# EAGLE design ledstringpowerMar2021 (EAGLE 9.6.2)
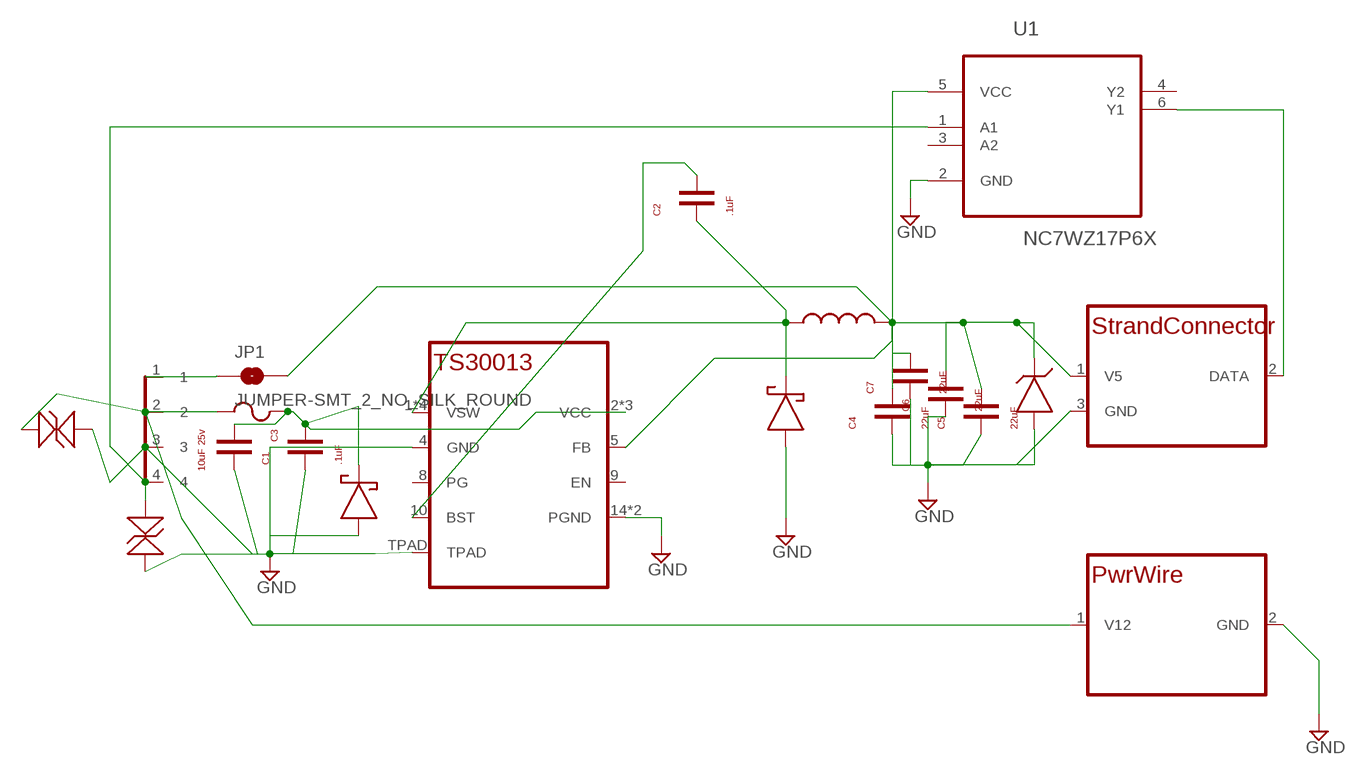
[diagram p0: schematic, sheet 1]

## Parts
C1  .1uF  CAPACITOR_NONPOLARC0603  [C0603]
C2  .1uF  CAPACITOR_NONPOLARC0603  [C0603]
C3  10uF 25v  CL31A106MAHNNNEC1206  [C1206]
C4  22uF  GRM188R61A226ME15DC0603  [C0603]
C5  22uF  GRM188R61A226ME15DC0603  [C0603]
C6  22uF  GRM188R61A226ME15DC0603  [C0603]
C7  22uF  GRM188R61A226ME15DC0603  [C0603]
D2  LS54LS54DEVINST  [LS54]
F1  3A  FUSER0603  [R0603]
IC1  TS30013QFN16  [QFN16]
JP1  JUMPER-SMT_2_NO_SILK_ROUND  [SMT-JUMPER_2_NO_SILK_ROUND]
L1  SRN5040TA-4R7MSRN5040TA  [SRN5040TA]
TVS1  DESD5V0U1BL-7BDFN1006-2  [DFN1006-2]
TVS2  DESD5V0U1BL-7BDFN1006-2  [DFN1006-2]
U1  NC7WZ17P6X  [SOT65P210X110-6N]
U$1  1SMB5930BT3G1SMB5930BT3GDEVINST  [1SMB5930BT3G]
U$2  MMSZ5231BT3G-5V1-ZENERSOD123DEVINST  [SOD123]
U$3  TE-1969806-1TE-1969806-1  [TE-1969806-1]
U$5  LEDSTRANDDLEDWIREP  [LEDWIREP]
U$8  PWRWIREDPWRWIREP  [PWRWIREP]

## Nets
DATA: TVS2.2 U1.1(A1) U$3.4
GND: C1.1 C3.2 C4.1 C5.1 C6.1 C7.1 D2.1 IC1.4(GND) IC1.14(PGND) IC1.15(PGND) IC1.TPAD TVS1.1 TVS2.1 U1.2(GND) U$1.1 U$2.1 U$3.3 U$5.3(GND) U$8.2(GND)
N$1: U1.6(Y1) U$5.2(DATA)
N$3: C2.1 D2.2 IC1.1(VSW) IC1.12(VSW) IC1.13(VSW) IC1.16(VSW) L1.1
N$5: C2.2 IC1.10(BST)
N$7: JP1.1 U$3.1
V5: C4.2 C5.2 C6.2 C7.2 IC1.5(FB) JP1.2 L1.2 U1.5(VCC) U$2.2 U$5.1(V5)
V12: F1.1 TVS1.2 U$3.2 U$8.1(V12)
VCC: C1.2 C3.1 F1.2 IC1.2(VCC) IC1.3(VCC) IC1.11(VCC) U$1.2
Unconnected: IC1.8(PG) IC1.9(EN) U1.3(A2) U1.4(Y2)

## Library data of the parts
C1 C2 = ledinlinesupply:CAPACITOR_NONPOLAR
C3 = ledinlinesupply:CL31A106MAHNNNE
C4-C7 = ledinlinesupply:GRM188R61A226ME15D
D2 = ledinlinesupply:LS54
F1 = ledinlinesupply:FUSE
IC1 = ledinlinesupply1:TS30013
JP1 = SparkFun-Jumpers:JUMPER-SMT_2_NO: Normally open jumper This jumper has two pads in close proximity to each other. Apply solder to close the connection. Round pads are easier to solder for beginners, but are a lot larger. SparkFun Product that uses the round pads: SparkFun EL Sequencer <https://www.sparkfun.com/products/12781>
L1 = ledinlinesupply:SRN5040TA-4R7M
TVS1 TVS2 = ledinlinesupply:DESD5V0U1BL-7B
U1 = NC7WZ17P6X_dual_schmitt_buffer:NC7WZ17P6X: Dual Buffer; MPN: NC7WZ17P6X; OC_FARNELL: 1651986; OC_NEWARK: 38C7625; PACKAGE: SC-70-6; SUPPLIER: FAIRCHILD SEMICONDUCTOR
U$1 = ledinlinesupply:1SMB5930BT3G
U$2 = ledinlinesupply:MMSZ5231BT3G-5V1-ZENER
U$3 = ledinlinesupply:TE-1969806-1
U$5 = ledinlinesupply:LEDSTRANDD
U$8 = ledinlinesupply:PWRWIRED

## Board
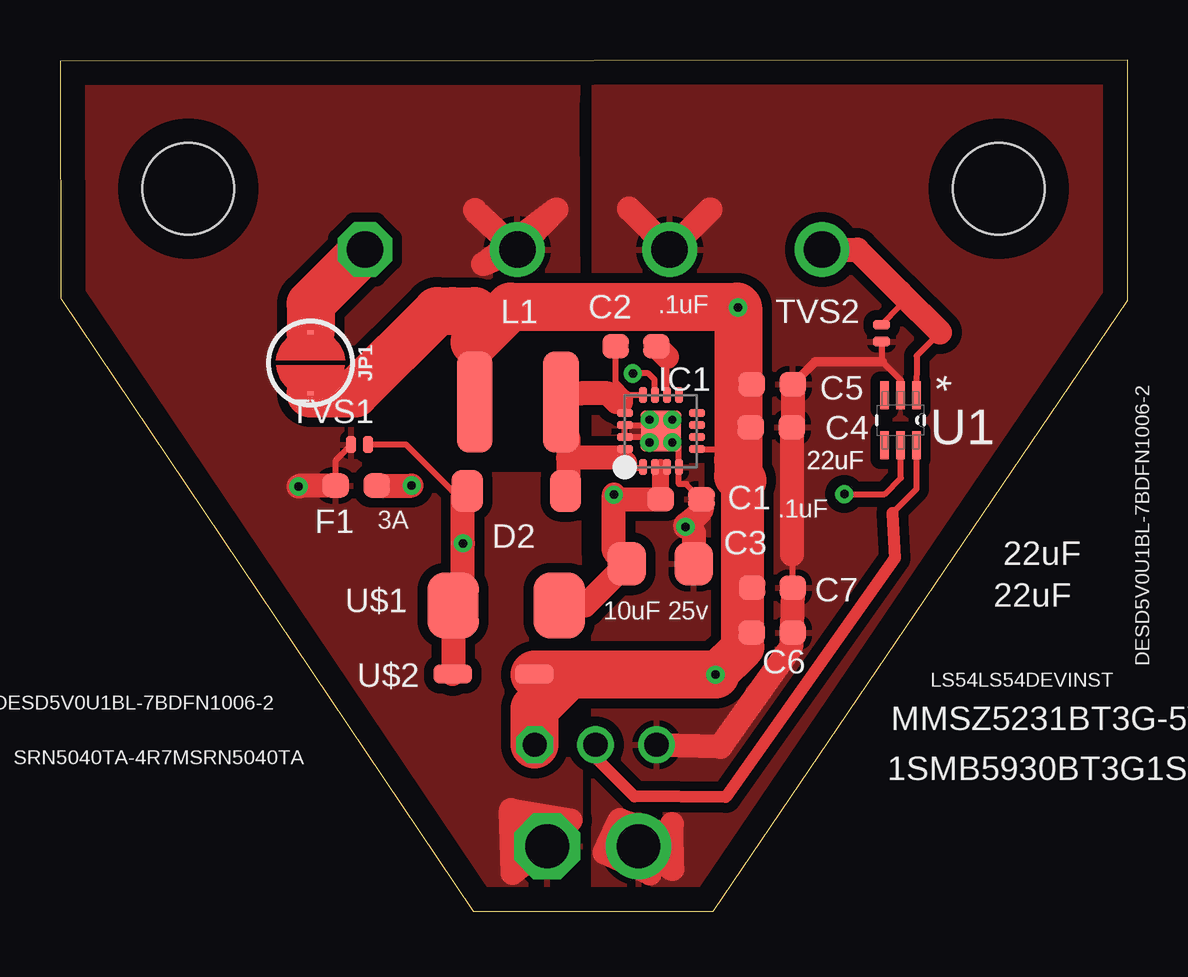
[diagram p1: board, top side]
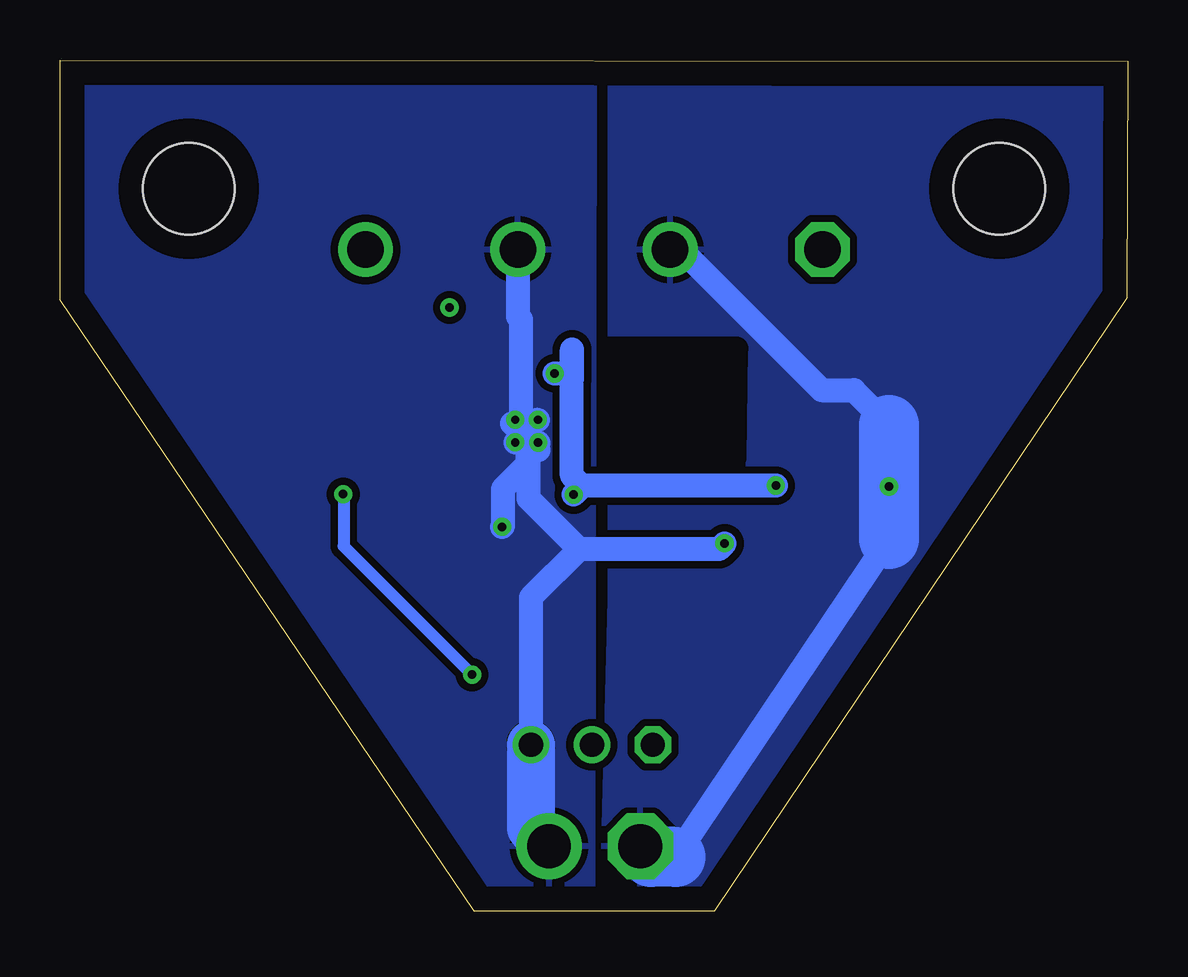
[diagram p2: board, bottom side, seen from below]

Size 44.48 x 35.47 mm. Coordinates in mm from the lower left corner, seen from the top.
Outline: 17.21,0 27.21,0 44.48,25.47 44.48,35.47 0,35.41 0.03,25.55 17.21,0
Copper layers (1*16): Top 0.035mm / dielectric 1.5mm / Bottom 0.035mm
Design rules "default": minimum track width 6mil, minimum drill 0.35mm, track to track 6mil, track to pad 6mil, pad to pad 6mil, via to via 6mil, smd to smd 6mil, copper to edge 40mil, drill to drill 6mil, minimum pad ring 10mil, minimum via ring 8mil, stop-mask expansion 4mil, vias tented up to drill 0mil, thermal gap 10mil
tRestrict: area 18.2,18.9 to 19.8,22.9
bRestrict: area 16.3,18.9 to 21.5,23.4

### Footprints (pad centres in the part's own frame; a part is rotated, then mirrored left to right if it is on the bottom)
C0603 = smd 1.1 x 1: 1 -0.85,0; 2 0.85,0
C1206 = smd 1.6 x 1.8: 1 -1.4,0; 2 1.4,0
LS54 = smd 1.3 x 1.75: 1 -2.05,0; 2 2.05,0
R0603 = smd 1.1 x 1: 1 -0.85,0; 2 0.85,0
QFN16 = smd 0.65 x 0.34: 1 -1.5,0.75; 2 -1.5,0.25; 3 -1.5,-0.25; 4 -1.5,-0.75; 9 1.5,-0.75; 10 1.5,-0.25; 11 1.5,0.25; 12 1.5,0.75 | smd 0.34 x 0.65: 5 -0.75,-1.5; 6 -0.25,-1.5; 7 0.25,-1.5; 8 0.75,-1.5; 13 0.75,1.5; 14 0.25,1.5; 15 -0.25,1.5; 16 -0.75,1.5 | smd 1.7 x 1.7: TPAD 0,0
SMT-JUMPER_2_NO_SILK_ROUND = smd 0.152 x 0.305: 1 -1.27,0; 2 1.27,0
SRN5040TA = smd 1.5 x 4.2: 1 -1.8,0; 2 1.8,0
DFN1006-2 = smd 0.4 x 0.7: 1 -0.35,0; 2 0.35,0
SOT65P210X110-6N = smd 1.168 x 0.356: 1 -1.041,0.66; 2 -1.041,0; 3 -1.041,-0.66; 4 1.041,-0.66; 5 1.041,0; 6 1.041,0.66
1SMB5930BT3G = smd 2.159 x 2.743: 1 -2.21,0; 2 2.21,0
SOD123 = smd 1.6 x 0.8: 1 -1.7,0; 2 1.7,0
TE-1969806-1 = drill 1.52 octagon: 1 -9.525,0 | drill 1.52: 2 -3.175,0; 3 3.175,0; 4 9.525,0 | hole 3.81: -16.89,2.54; 16.89,2.54
LEDWIREP = drill 1.016 octagon: 1 -2.54,0 | drill 1.016: 2 0,0; 3 2.54,0
PWRWIREP = drill 1.829 octagon: 1 -1.905,0 | drill 1.829: 2 1.905,0

### Placement (x,y rotation side)
C1  25.88,17.17 180 top
C2  24,23.54 0 top
C3  25.01,14.48 0 top
C4  29.64,20.17 180 top
C5  29.68,21.96 180 top
C6  29.68,11.61 180 top
C7  29.69,13.48 180 top
D2  19.02,17.52 0 top
F1  12.34,17.74 0 top
IC1  25.04,20.01 90 top
JP1  10.44,22.85 270 top
L1  19.08,21.22 180 top
TVS1  12.48,19.44 180 top
TVS2  34.23,24.09 90 top
U1  35.02,20.46 270 top
U$1  18.59,12.74 0 top
U$2  18.06,9.88 0 top
U$3  22.23,27.57 0 top
U$5  22.32,6.94 0 top
U$8  22.2,2.71 0 top

### Tracks (layer width: path | path; a pad name or v marks a point on that pad's centre or on a via)
DATA
  Top 0.25: 36.67,24.12 35.69,23.14 U1.1 | 35,25.8 35,25.21 TVS2.2
  Top 1: U$3.4 33.22,27.57 35,25.8 36.67,24.12
GND  (via drill 0.35)
  Top 0.25: IC1.TPAD v24.56,19.54 | 24.79,19.76 IC1.15 IC1.14 24.33,20.26 24.55,20.48 v24.57,20.48 | v25.51,19.54 25.53,19.56 25.62,19.56 25.76,19.42 25.76,18.54 IC1.4 25.79,17.81 25.8,17.8 26.1,17.8 C1.1 | TVS2.1 34.23,22.93 34.27,22.89 35.02,22.14 | D2.1 16.34,17.52 14.42,19.44 TVS1.1 | C6.1 C7.1 30.54,14.81 30.49,14.86
  Top 0.3: 35.02,22.14 U1.2
  Top 0.4: C5.1 31.46,22.89 34.27,22.89
  Top 0.5: v25.51,20.48 25.13,20.01
  Top 1: IC1.TPAD | IC1.TPAD 24.79,19.76 | C1.1 26.73,16.71 26.1,16.08 | v26.06,16.02 26.06,16.12 26.1,16.08 | D2.1 16.79,17.34 v16.79,15.33 16.79,13.15 U$1.1 16.38,9.9 U$2.1 | 26.1,16.08 26.41,15.77 C3.2 | C5.1 30.53,20.21 C4.1 30.49,14.86 | U$5.3 24.88,6.92 27.51,6.85 30.46,11.02 30.54,13.34 C7.1 | 25.13,20.01 IC1.TPAD | U$3.3 27.09,29.25 27.11,29.25 25.43,27.57 U$3.3 | U$3.3 23.71,29.27 23.71,29.28 25.4,27.59 U$3.3 | U$8.2 25.52,1.76 25.49,3.63 24.58,1.58 22.69,2.44 23.33,3.8 24.99,3.29 23.57,2.99 U$8.2
  Bottom 0.25: 24.54,19.22 24.54,19.52
  Bottom 0.5: 25.64,20.32 v25.51,20.48
  Bottom 1: U$3.3 25.4,24.77 25.28,24.65 25.28,19.82 25.04,20.06 | 25.04,19.72 25.01,19.69 | 24.96,19.64 24.54,19.22 | 24.54,19.52 v24.56,19.54 | 25.04,20.06 24.62,20.48 v24.57,20.48 | 25.04,20.06 25.04,19.72 | v25.51,19.54 25.33,19.72 25.04,19.72 | 25.01,19.69 25.01,18.62 26.03,17.6 26.03,16.05 v26.06,16.02 | 25.01,19.69 24.96,19.64 | 22.85,15.09 24.96,17.2 24.96,19.64 | 22.85,15.09 17.02,15.09 v16.79,15.32 v16.79,15.33 | 22.85,15.09 24.86,13.08 U$5.3 | 25.04,19.72 25.64,20.32
  Bottom 2: U$5.3 24.86,3.47 U$8.2
  pour Bottom (isolate 0.305): 22.23,35.13 22.3,0.7 27.1,0.7 44.01,25.73 44.01,35 43.68,34.98 43.03,34.98
  pour Top (isolate 0.406): 22.26,35.26 44.21,35.23 44.21,25.56 27.16,0.32 22.23,0.32
N$1
  Top 0.25: U1.6 35.68,17.59 34.68,16.59
  Top 0.5: 34.68,16.59 34.79,14.72 27.73,4.76 23.93,4.79 22.32,6.4 U$5.2
N$3
  Top 0.25: IC1.13 23.52,20.78 23.52,21.36 23.52,21.51 IC1.12 23.68,21.51 23.15,22.04 C2.1 | IC1.16 23.54,18.7 23.54,18.49 24.27,18.49 IC1.1
  Top 0.3: 21.17,19.77 21.17,20.93 L1.1 21.24,21.58 21.69,21.58
  Top 0.7: 23.52,21.36 23.38,21.22
  Top 1: D2.2 21.17,17.62 21.17,18.89 | 21.17,19.77 21.17,18.89 | 23.38,21.22 23.19,21.22 22.83,21.58 21.69,21.58 | 23.54,18.7 23.35,18.89 21.17,18.89
N$5
  Top 0.25: IC1.10 25.29,23.1
  Top 1: 25.29,23.1 C2.2
N$7
  Top 2: U$3.1 10.44,25.3 JP1.1
V5  (via drill 0.35)
  Top 0.25: IC1.5 27.79,19.26 28.25,18.8 28.25,19.63 C4.2 28.79,21.92 C5.2 | v32.68,17.38 34.36,17.38 35.04,18.06 35.04,19.4 U1.5 | C7.2 C6.2 28.83,11.38 v27.31,9.86
  Top 0.3: L1.2 17.28,23.71 | 17.86,24.3 17.06,24.3 16.35,25.01
  Top 1: U$5.1 19.78,9.86 U$2.2
  Top 1.8: 28.43,17.95 28.43,11.04 28.46,11.01 v27.31,9.86
  Top 2: 17.28,23.71 17.86,24.3 18.76,25.19 28.22,25.19 v28.25,25.16 28.25,18.8 28.25,18.14 28.43,17.95 | v27.31,9.86 21.2,9.86 | 21.2,9.86 19.78,9.86 | U$5.1 19.78,8.44 21.2,9.86 | 17.28,25.01 16.35,25.01 15.73,25.01 15.72,25.01 15.71,25.01 12.28,21.58 JP1.2
  Bottom 0.5: v27.31,9.86 32.66,15.21 32.66,17.36 v32.68,17.38
V12  (via drill 0.35)
  Top 0.25: F1.1 11.49,18.8 TVS1.2
  Top 1: F1.1 10.02,17.74 9.98,17.7 v9.94,17.7 | 17.29,29.22 U$3.2 | U$3.2 20.68,29.25 17.63,26.96 U$3.2 | U$8.1 18.86,1.6 18.79,4.22 21.27,3.79
  Bottom 1: U$3.2 18.6,27.57 12.75,21.72 11.4,21.72 9.94,20.26 | 9.94,15.51 18.84,2.27
  Bottom 2.5: 18.84,2.27 19.85,2.27 U$8.1 | 9.94,20.26 v9.94,17.7 9.94,15.51
  pour Bottom (isolate 0.305): 21.89,0.35 17.42,0.45 0.51,25.68 0.51,34.69 21.55,34.71 21.55,12.99
  pour Top (isolate 0.406): 21.65,35.07 0.34,35.07 0.34,25.66 17.35,0.3 21.69,0.3 21.54,33.53 21.54,33.55 21.64,35.06
VCC  (via drill 0.35)
  Top 0.25: IC1.3 25.04,18.51 IC1.2 | IC1.11 24.78,22.15 24.52,22.41 v23.87,22.41
  Top 0.5: 25.03,18.5 25.04,18.51
  Top 0.7: C1.2 25.03,18.5
  Top 1: F1.2 v14.65,17.74 | C1.2 23.27,17.17 v23.08,17.36 23.08,15.01 C3.1 21.87,12.74 U$1.2
  Bottom 1: v14.65,17.74 22.74,17.74 | v23.08,17.36 22.72,17.72 22.74,17.74 | 22.74,17.74 23.15,18.15 23.15,23.41 23.14,23.41 23.14,22.17 23.38,22.41 v23.87,22.41

### Text on the board
tDocu: DATA | V5 | GND | V12 | GND
bDocu: LED Strand Power | Rev 3.1 Mar 11, 2021 | Andrew Stone | DATA | V5 | GND | V12 | GND